# EAGLE design mppt (EAGLE 9.6.1)
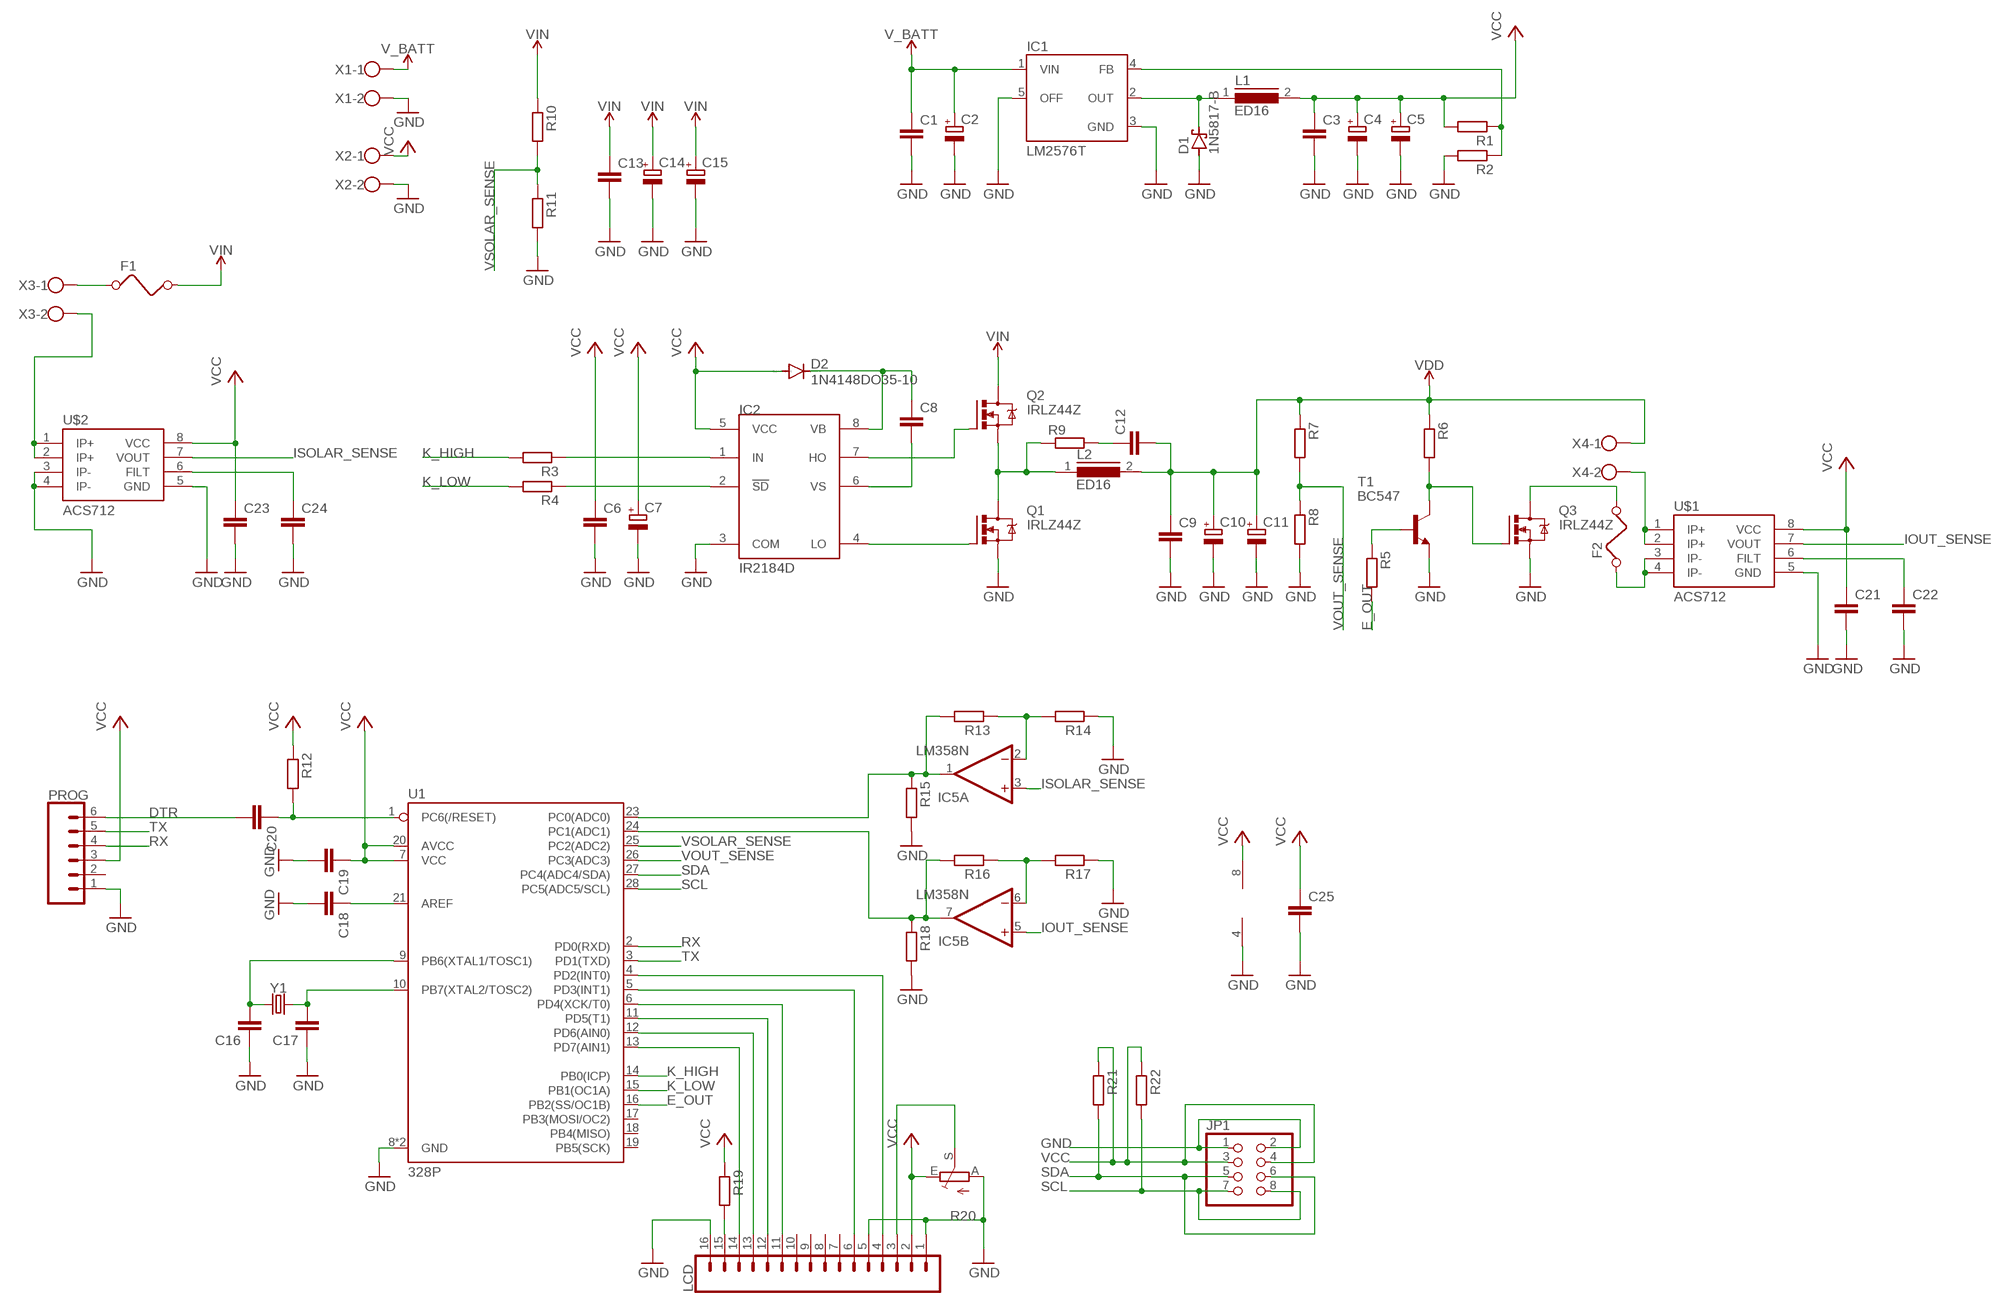
[diagram p0: schematic, sheet 1]

## Parts
C1  C-EU025-024X044  [C025-024X044]
C2  CPOL-EUE5-6  [E5-6]
C3  C-EU025-024X044  [C025-024X044]
C4  CPOL-EUE5-6  [E5-6]
C5  CPOL-EUE5-6  [E5-6]
C6  C-EU025-024X044  [C025-024X044]
C7  CPOL-EUE5-6  [E5-6]
C8  C-EU025-024X044  [C025-024X044]
C9  C-EU025-024X044  [C025-024X044]
C10  CPOL-EUE7.5-16  [E7,5-16]
C11  CPOL-EUE7.5-16  [E7,5-16]
C12  C-EU025-024X044  [C025-024X044]
C13  C-EU025-024X044  [C025-024X044]
C14  CPOL-EUE7.5-16  [E7,5-16]
C15  CPOL-EUE7.5-16  [E7,5-16]
C16  C-EU025-024X044  [C025-024X044]
C17  C-EU025-024X044  [C025-024X044]
C18  C-EU025-024X044  [C025-024X044]
C19  C-EU025-024X044  [C025-024X044]
C20  C-EU025-024X044  [C025-024X044]
C21  C-EU025-024X044  [C025-024X044]
C22  C-EU025-024X044  [C025-024X044]
C23  C-EU025-024X044  [C025-024X044]
C24  C-EU025-024X044  [C025-024X044]
C25  C-EU025-024X044  [C025-024X044]
D1  1N5817-B  [DO41-7.6]
D2  1N4148DO35-10  [DO35-10]
F1  FUSE  [FUSE]
F2  FUSE  [FUSE]
IC1  LM2576T  [TO220-5]
IC2  IR2184D  [DIL08]
IC5  LM358N  [DIL08]
JP1  PINHD-2X4  [2X04]
L1  ED16  [ED16]
L2  ED16  [ED16]
LCD  CONN_16LONGPADS  [1X16_LONGPADS]
PROG  CONN_06LONGPADS  [1X06_LONGPADS]
Q1  IRLZ44Z  [TO220BH]
Q2  IRLZ44Z  [TO220BH]
Q3  IRLZ44Z  [TO220BH]
R1  R-EU_0207/10  [0207/10]
R2  R-EU_0207/10  [0207/10]
R3  R-EU_0207/10  [0207/10]
R4  R-EU_0207/10  [0207/10]
R5  R-EU_0207/10  [0207/10]
R6  R-EU_0207/10  [0207/10]
R7  R-EU_0207/10  [0207/10]
R8  R-EU_0207/10  [0207/10]
R9  R-EU_0207/10  [0207/10]
R10  R-EU_0207/10  [0207/10]
R11  R-EU_0207/10  [0207/10]
R12  R-EU_0207/10  [0207/10]
R13  R-EU_0207/10  [0207/10]
R14  R-EU_0207/10  [0207/10]
R15  R-EU_0207/10  [0207/10]
R16  R-EU_0207/10  [0207/10]
R17  R-EU_0207/10  [0207/10]
R18  R-EU_0207/10  [0207/10]
R19  R-EU_0207/10  [0207/10]
R20  TRIM_EU-B64Y  [B64Y]
R21  R-EU_0207/10  [0207/10]
R22  R-EU_0207/10  [0207/10]
T1  BC547  [TO92]
U1  328P  ATMEGA328P_PDIP  [DIP28]
U$1  ACS712  [SO08]
U$2  ACS712  [SO08]
X1  W237-102  [W237-102]
X2  W237-102  [W237-102]
X3  W237-102  [W237-102]
X4  W237-102  [W237-102]
Y1  CRYSTALPTH-HC49UV  [HC49U]

## Nets
DTR: C20.2 PROG.6
E_OUT: R5.2 U1.16(PB2(SS/OC1B))
GND: C1.2 C2.- C3.2 C4.- C5.- C6.2 C7.- C9.2 C10.- C11.- C13.2 C14.- C15.- C16.1 C17.1 C18.2 C19.2 C21.2 C22.2 C23.2 C24.2 C25.2 D1.A IC1.3(GND) IC1.5(OFF) IC2.3(COM) IC5.4(P:V-) JP1.1 JP1.2 LCD.1 LCD.5 LCD.16 PROG.1 Q1.S Q3.S R2.2 R8.2 R11.2 R14.1 R15.2 R17.1 R18.2 R20.A T1.1(E) U1.8(GND) U1.22(GND) U$1.5(GND) U$2.3(IP-) U$2.4(IP-) U$2.5(GND) X1.2 X2.2
IOUT_SENSE: IC5.5(B:+IN) U$1.7(VOUT)
ISOLAR_SENSE: IC5.3(A:+IN) U$2.7(VOUT)
K_HIGH: R3.2 U1.14(PB0(ICP))
K_LOW: R4.2 U1.15(PB1(OC1A))
N$1: L2.1 Q1.D Q2.S R9.1
N$2: D1.C IC1.2(OUT) L1.1
N$3: IC2.7(HO) Q2.G
N$4: IC1.4(FB) R1.1 R2.1
N$5: IC2.4(LO) Q1.G
N$6: IC5.1(A:OUT) R13.2 R15.1 U1.23(PC0(ADC0))
N$7: IC2.1(IN) R3.1
N$8: IC2.2(!SD) R4.1
N$9: R5.1 T1.2(B)
N$10: Q3.G R6.2 T1.3(C)
N$11: C22.1 U$1.6(FILT)
N$12: F2.2 Q3.D
N$13: LCD.15 R19.2
N$14: IC5.7(B:OUT) R16.2 R18.1 U1.24(PC1(ADC1))
N$15: C24.1 U$2.6(FILT)
N$16: C16.2 U1.9(PB6(XTAL1/TOSC1)) Y1.1
N$17: C12.1 R9.2
N$18: C17.2 U1.10(PB7(XTAL2/TOSC2)) Y1.2
N$19: C20.1 R12.2 U1.1(PC6(/RESET))
N$20: U$2.1(IP+) U$2.2(IP+) X3.2
N$21: F1.1 X3.1
N$22: C18.1 U1.21(AREF)
N$23: F2.1 U$1.3(IP-) U$1.4(IP-)
N$24: IC5.2(A:-IN) R13.1 R14.2
N$25: IC5.6(B:-IN) R16.1 R17.2
N$26: LCD.3 R20.S
N$27: LCD.4 U1.4(PD2(INT0))
N$28: LCD.6 U1.5(PD3(INT1))
N$29: LCD.11 U1.6(PD4(XCK/T0))
N$30: LCD.12 U1.11(PD5(T1))
N$31: LCD.13 U1.12(PD6(AIN0))
N$32: LCD.14 U1.13(PD7(AIN1))
N$33: U$1.1(IP+) U$1.2(IP+) X4.2
RX: PROG.4 U1.2(PD0(RXD))
SCL: JP1.7 JP1.8 R22.2 U1.28(PC5(ADC5/SCL))
SDA: JP1.5 JP1.6 R21.2 U1.27(PC4(ADC4/SDA))
TX: PROG.5 U1.3(PD1(TXD))
V_BATT: C1.1 C2.+ IC1.1(VIN) X1.1
VB: C8.1 D2.C IC2.8(VB)
VCC: C3.1 C4.+ C5.+ C6.1 C7.+ C19.1 C21.1 C23.1 C25.1 D2.A IC2.5(VCC) IC5.8(P:V+) JP1.3 JP1.4 L1.2 LCD.2 PROG.3 R1.2 R12.1 R19.1 R20.E R21.1 R22.1 U1.7(VCC) U1.20(AVCC) U$1.8(VCC) U$2.8(VCC) X2.1
VDD: C9.1 C10.+ C11.+ C12.2 L2.2 R6.1 R7.1 X4.1
VIN: C13.1 C14.+ C15.+ F1.2 Q2.D R10.1
VOUT_SENSE: R7.2 R8.1 U1.26(PC3(ADC3))
VS: C8.2 IC2.6(VS)
VSOLAR_SENSE: R10.2 R11.1 U1.25(PC2(ADC2))
Unconnected: LCD.7 LCD.8 LCD.9 LCD.10 PROG.2 U1.17(PB3(MOSI/OC2)) U1.18(PB4(MISO)) U1.19(PB5(SCK))

## Library data of the parts
C1 C3 C6 C8 C9 C12 C13 C16-C25 = rcl:C-EU: CAPACITOR, European symbol; SPICEPREFIX: C
C2 C4 C5 C7 C10 C11 C14 C15 = rcl:CPOL-EU: POLARIZED CAPACITOR, European symbol; SPICEPREFIX: C
D1 = diode:1N581*: 1.0A SCHOTTKY BARRIER RECTIFIER Source: http://www.diodes.com/datasheets/ds23001.pdf
D2 = diode:1N4148: DIODE high speed (Philips)
F1 F2 = special:FUSE: FUSE 5 x 20 mm
IC1 = v-reg-3:LM2576: National Semiconductor <http://www.national.com> 3.0A "Simple Switcher"(c) 52kHz, Vout 1.23-37V (HV: 57V), Vin 40V (HV: 60V), 50µA standby current
IC2 = irs:IR2184
IC5 = linear:LM358: OP AMP also LM158; LM258; LM2904 Source: http://cache.national.com/ds/LM/LM158.pdf
JP1 = adafruit:PINHD-2X4: PIN HEADER
L1 L2 = inductors:ED16: INDUCTOR; SPICEPREFIX: L
LCD = SparkFun-Connectors:CONN_16: Multi connection point. Often used as Generic Header-pin footprint for 0.1 inch spaced/style header connections On any of the 0.1 inch spaced packages, you can populate with these: Break Away Headers - Straight <https://www.sparkfun.com/products/116> (PRT-00116) Break Away Male Headers - Right Angle <https://www.sparkfun.com/products/553> (PRT-00553) Female Headers <https://www.sparkfun.com/products/115> (PRT-00115) Break Away Headers - Machine Pin <https://www.sparkfun.com/products/117> (PRT-00117) Break Away Female Headers - Swiss Machine Pin <https://www.sparkfun.com/products/743> (PRT-00743) For SCREWTERMINALS and SPRING TERMINALS visit here: Screw Terimnals on SparkFun.com <https://www.sparkfun.com/search/results?term=Screw+Terminals> (5mm/3.5mm/2.54mm spacing) This device is also useful as a general connection point to wire up your design to another part of your project. Our various solder wires solder well into these plated through hole pads. Hook-Up Wire - Assortment (Stranded, 22 AWG) <https://www.sparkfun.com/products/11375> (PRT-11375) Hook-Up Wire - Assortment (Solid Core, 22 AWG) <https://www.sparkfun.com/products/11367> (PRT-11367) View the entire wire category on our website here <https://www.sparkfun.com/categories/141> Special notes: Molex polarized connector foot print use with SKU : PRT-08231 with associated crimp pins and housings. 1MM SMD Version SKU: PRT-10208 NOTES ON THE VARIANTS LOCK and LOCK_LONGPADS... This footprint was designed to help hold the alignment of a through-hole component (i.e. 6-pin header) while soldering it into place. You may notice that each hole has been shifted either up or down by 0.005 of an inch from it's more standard position (which is a perfectly straight line). This slight alteration caused the pins (the squares in the middle) to touch the edges of the holes. Because they are alternating, it causes a "brace" to hold the component in place. 0.005 has proven to be the perfect amount of "off-center" position when using our standard breakaway headers. Although looks a little odd when you look at the bare footprint, once you have a header in there, the alteration is very hard to notice. Also,if you push a header all the way into place, it is covered up entirely on the bottom side.
PROG = SparkFun-Connectors:CONN_06: Multi connection point. Often used as Generic Header-pin footprint for 0.1 inch spaced/style header connections On any of the 0.1 inch spaced packages, you can populate with these: Break Away Headers - Straight <https://www.sparkfun.com/products/116> (PRT-00116) Break Away Male Headers - Right Angle <https://www.sparkfun.com/products/553> (PRT-00553) Female Headers <https://www.sparkfun.com/products/115> (PRT-00115) Break Away Headers - Machine Pin <https://www.sparkfun.com/products/117> (PRT-00117) Break Away Female Headers - Swiss Machine Pin <https://www.sparkfun.com/products/743> (PRT-00743) Arduino Stackable Header - 6 Pin <https://www.sparkfun.com/products/9280> (PRT-09280) For SCREWTERMINALS and SPRING TERMINALS visit here: Screw Terimnals on SparkFun.com <https://www.sparkfun.com/search/results?term=Screw+Terminals> (5mm/3.5mm/2.54mm spacing) This device is also useful as a general connection point to wire up your design to another part of your project. Our various solder wires solder well into these plated through hole pads. Hook-Up Wire - Assortment (Stranded, 22 AWG) <https://www.sparkfun.com/products/11375> (PRT-11375) Hook-Up Wire - Assortment (Solid Core, 22 AWG) <https://www.sparkfun.com/products/11367> (PRT-11367) View the entire wire category on our website here <https://www.sparkfun.com/categories/141>
Q1-Q3 = transistor-power:IRLZ44Z: N-Channel HEXFET® Power MOSFET Logic Level AUTOMOTIVE MOSFET Source: http://www.irf.com/product-info/datasheets/data/irlz44zpbf.pdf
R1-R19 R21 R22 = rcl:R-EU_: RESISTOR, European symbol; SPICEPREFIX: R
R20 = pot:TRIM_EU-: POTENTIOMETER
T1 = transistor:BC547: NPN TRANSISTOR
U1 = SparkFun-IC-Microcontroller:ATMEGA328P_PDIP: Atmel 328P Through hole ATMEGA328P uC used in the Arduino 32kb flash, 1k EEPROM, 2k SRAM Datasheet <http://www.sparkfun.com/datasheets/Components/SMD/ATMega328.pdf> SparkFun Products Storefront component: AVR 28 Pin 20MHz 32K 6A/D - ATMega328P <https://www.sparkfun.com/products/9061> (COM-09061) SparkFun Simon Says - Through-Hole Soldering Kit <https://www.sparkfun.com/products/10547> (KIT-10547) SparkFun Learn to Solder - Simon Says <https://www.sparkfun.com/products/13708> (KIT-13708) SparkFun BigTime Watch Kit <https://www.sparkfun.com/products/11734> (KIT-11734) SparkFun ClockIt <https://www.sparkfun.com/products/10930> (KIT-10930) SparkFun Serial Enabled LCD Kit <https://www.sparkfun.com/products/10097> (LCD-10097) SparkFun Simon Tilts - Through Hole Soldering Kit <https://www.sparkfun.com/products/12634> (KIT-12634) SparkFun Frequency Counter Kit <https://www.sparkfun.com/products/10140> (KIT-10140) FabFM Radio Kit <https://www.sparkfun.com/products/11043> (KIT-11043) SparkFun Binary Blaster Kit <https://www.sparkfun.com/products/12037> (KIT-12037) SparkFun Metro-Gnome <https://www.sparkfun.com/products/9236> (KIT-09236) ATmega328 with Arduino Optiboot (Uno) <https://www.sparkfun.com/products/10524> (DEV-10524); PROD_ID: IC-09136
U$1 U$2 = SparkFun-Sensors:ACS712: ACS712 Hall-effect-based isolated linear current sensor Datasheet <http://www.sparkfun.com/datasheets/BreakoutBoards/0712.pdf> SparkFun Products SparkFun Low Current Sensor Breakout - ACS712 <https://www.sparkfun.com/products/8883> (SEN-08883); PROD_ID: IC-08964
X1-X4 = con-wago-500:W237-102: WAGO SCREW CLAMP; MPN: 237-102; OC_FARNELL: unknown; OC_NEWARK: 70K9898
Y1 = SparkFun-Clocks:CRYSTAL: Crystals (Generic) These are passive quartz crystals, which can be used as a clock source for a microcontroller. Crystal's are two-terminal devices. They require external "load" capacitors to generate an oscillating signal.

## Board
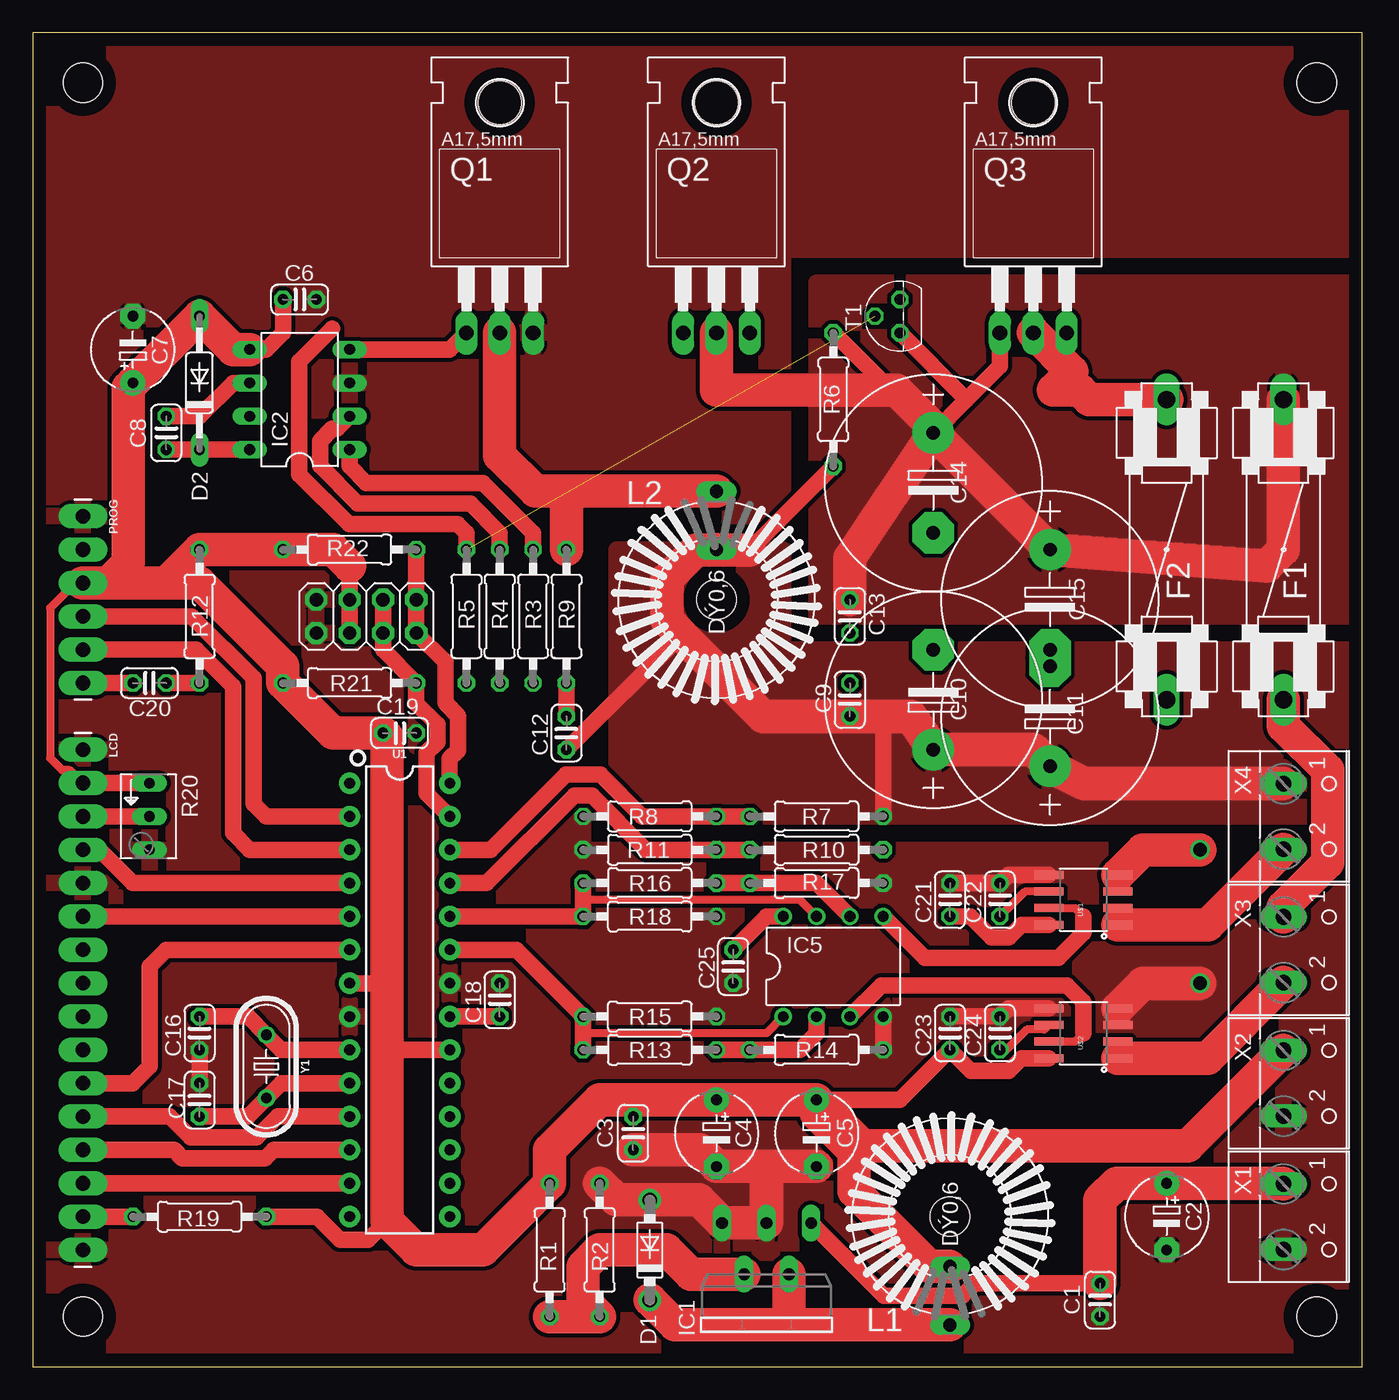
[diagram p1: board, top side]
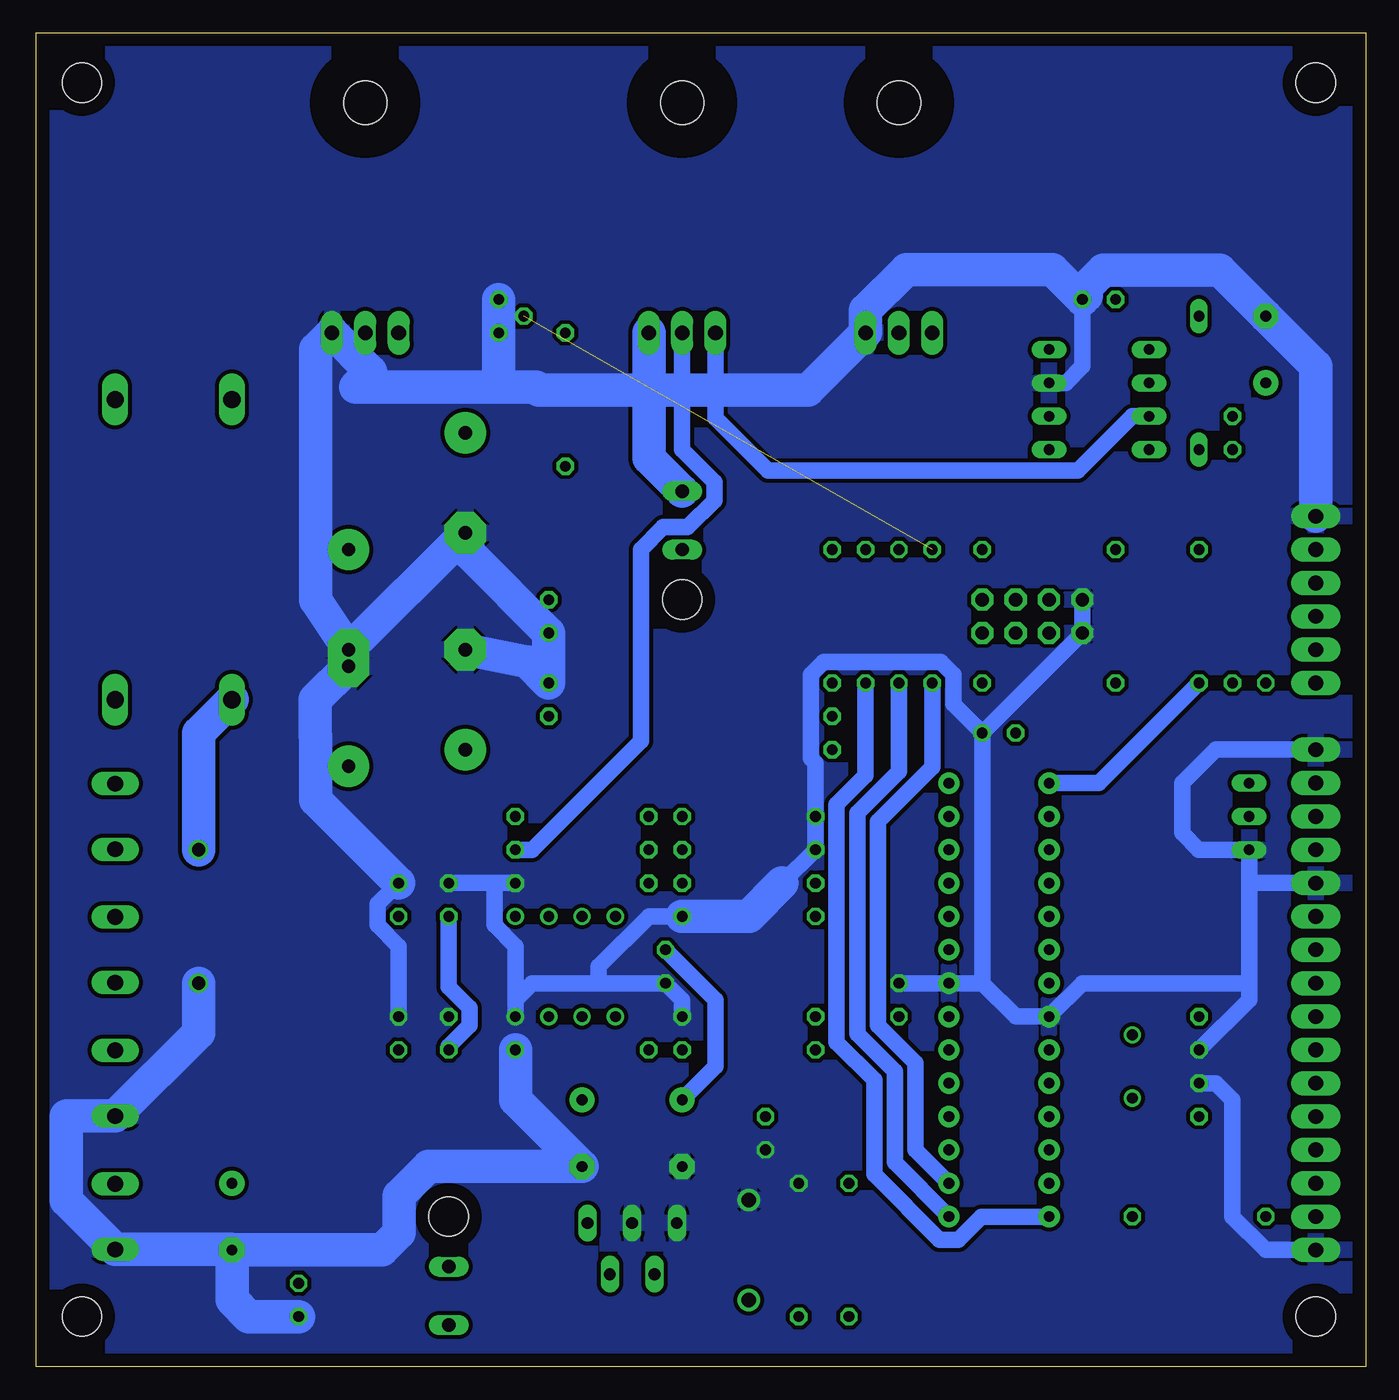
[diagram p2: board, bottom side, seen from below]

Size 101.27 x 101.59 mm. Coordinates in mm from the lower left corner, seen from the top.
Outline: 0,0 101.27,0 101.27,101.59 0,101.59 0,0
Copper layers (1*16): Top 0.035mm / dielectric 1.5mm / Bottom 0.035mm
Design rules "default *": minimum track width 6mil, minimum drill 0.35mm, track to track 12mil, track to pad 12mil, pad to pad 12mil, via to via 12mil, smd to smd 12mil, copper to edge 40mil, drill to drill 6mil, minimum pad ring 10mil, minimum via ring 8mil, stop-mask expansion 4mil, vias tented up to drill 0mil, thermal gap 10mil
Holes 3 mm at 3.81,97.79 3.81,3.81 97.79,3.81 97.79,97.79 52.07,58.42 69.85,11.43

### Footprints (pad centres in the part's own frame; a part is rotated, then mirrored left to right if it is on the bottom)
C025-024X044 = drill 0.813 octagon: 1 -1.27,0; 2 1.27,0
E5-6 = drill 0.813 pad 1.905: + -2.54,0 | drill 0.813 pad 1.905 octagon: - 2.54,0
E7,5-16 = drill 1.016 pad 3.15: + -3.81,0 | drill 1.016 pad 3.15 octagon: - 3.81,0
DO41-7.6 = drill 1.1 pad 1.7: A 3.81,0; C -3.81,0
DO35-10 = drill 0.813 long: A 5.08,0; C -5.08,0
FUSE = drill 1.321 long: 1 -11.43,0; 2 11.43,0
TO220-5 = drill 0.9 long: 1 -3.4,-8.4; 2 -1.7,-4.5; 3 0,-8.4; 4 1.7,-4.5; 5 3.4,-8.4
DIL08 = drill 0.813 long: 1 -3.81,-3.81; 2 -1.27,-3.81; 3 1.27,-3.81; 4 3.81,-3.81; 5 3.81,3.81; 6 1.27,3.81; 7 -1.27,3.81; 8 -3.81,3.81
DIL08' = drill 0.813 pad 1.27: 1 -3.81,-3.81; 2 -1.27,-3.81; 3 1.27,-3.81; 4 3.81,-3.81; 5 3.81,3.81; 6 1.27,3.81; 7 -1.27,3.81; 8 -3.81,3.81
2X04 = drill 1.016 pad 1.676 octagon: 1 -3.81,-1.27; 2 -3.81,1.27; 3 -1.27,-1.27; 4 -1.27,1.27; 5 1.27,-1.27; 6 1.27,1.27; 7 3.81,-1.27; 8 3.81,1.27
ED16 = drill 1.016 long: 1 -8.255,0; 2 -3.81,0
1X16_LONGPADS = drill 1.118 pad 1.88 long: 1 0,0; 2 2.54,0; 3 5.08,0; 4 7.62,0; 5 10.16,0; 6 12.7,0; 7 15.24,0; 8 17.78,0; 9 20.32,0; 10 22.86,0; 11 25.4,0; 12 27.94,0; 13 30.48,0; 14 33.02,0; 15 35.56,0; 16 38.1,0
1X06_LONGPADS = drill 1.118 pad 1.88 long: 1 0,0; 2 2.54,0; 3 5.08,0; 4 7.62,0; 5 10.16,0; 6 12.7,0
TO220BH = drill 1.118 long: D 0,-6.35; G -2.54,-6.35; S 2.54,-6.35 | hole 3.302: 0,11.176
0207/10 = drill 0.813 octagon: 1 -5.08,0; 2 5.08,0
B64Y = drill 0.813 long: A 2.54,0; E -2.54,0; S 0,0
TO92 = drill 0.813 octagon: 1 1.27,0; 2 0,1.905; 3 -1.27,0
DIP28 = drill 0.813 pad 1.626: 1 -16.51,-3.81; 2 -13.97,-3.81; 3 -11.43,-3.81; 4 -8.89,-3.81; 5 -6.35,-3.81; 6 -3.81,-3.81; 7 -1.27,-3.81; 8 1.27,-3.81; 9 3.81,-3.81; 10 6.35,-3.81; 11 8.89,-3.81; 12 11.43,-3.81; 13 13.97,-3.81; 14 16.51,-3.81; 15 16.51,3.81; 16 13.97,3.81; 17 11.43,3.81; 18 8.89,3.81; 19 6.35,3.81; 20 3.81,3.81; 21 1.27,3.81; 22 -1.27,3.81; 23 -3.81,3.81; 24 -6.35,3.81; 25 -8.89,3.81; 26 -11.43,3.81; 27 -13.97,3.81; 28 -16.51,3.81
SO08 = smd 0.61 x 2.21: 1 -1.905,-2.616; 2 -0.635,-2.616; 3 0.635,-2.616; 4 1.905,-2.616; 5 1.905,2.616; 6 0.635,2.616; 7 -0.635,2.616; 8 -1.905,2.616
W237-102 = drill 1.194 long: 1 -2.5,-1.27; 2 2.5,-1.27
HC49U = drill 0.813: 1 -2.413,0; 2 2.413,0

### Placement (x,y rotation side)
C1  81.28,5.08 270 top
C2  86.36,11.43 270 top
C3  45.72,17.78 270 top
C4  52.07,17.78 270 top
C5  59.69,17.78 270 top
C6  20.32,81.28 0 top
C7  7.62,77.47 90 top
C8  10.16,71.12 90 top
C9  62.23,50.8 90 top
C10  68.58,50.8 90 top
C11  77.47,49.53 90 top
C12  40.64,48.26 270 top
C13  62.23,57.15 270 top
C14  68.58,67.31 270 top
C15  77.47,58.42 270 top
C16  12.7,25.4 90 top
C17  12.7,20.32 270 top
C18  35.56,27.94 90 top
C19  27.94,48.26 0 top
C20  8.89,52.07 180 top
C21  69.85,35.56 90 top
C22  73.66,35.56 90 top
C23  69.85,25.4 90 top
C24  73.66,25.4 90 top
C25  53.34,30.48 270 top
D1  46.99,8.89 90 top
D2  12.7,74.93 90 top
F1  95.25,62.23 90 top
F2  86.36,62.23 90 top
IC1  55.88,2.54 180 top
IC2  20.32,73.66 90 top
IC5  LM358N  [DIL08']  60.96,30.48 0 top
JP1  25.4,57.15 0 top
L1  69.85,11.43 90 top
L2  52.07,58.42 270 top
LCD  3.81,46.99 270 top
PROG  3.81,64.77 270 top
Q1  35.56,85.09 0 top
Q2  52.07,85.09 0 top
Q3  76.2,85.09 0 top
R1  39.37,8.89 90 top
R2  43.18,8.89 90 top
R3  38.1,57.15 270 top
R4  35.56,57.15 270 top
R5  33.02,57.15 270 top
R6  60.96,73.66 90 top
R7  59.69,41.91 180 top
R8  46.99,41.91 180 top
R9  40.64,57.15 270 top
R10  59.69,39.37 180 top
R11  46.99,39.37 180 top
R12  12.7,57.15 270 top
R13  46.99,24.13 180 top
R14  59.69,24.13 180 top
R15  46.99,26.67 0 top
R16  46.99,36.83 180 top
R17  59.69,36.83 180 top
R18  46.99,34.29 0 top
R19  12.7,11.43 180 top
R20  8.89,41.91 270 top
R21  24.13,52.07 0 top
R22  24.13,62.23 0 top
T1  66.04,80.01 90 top
U1  27.94,27.94 270 top
U$1  80.01,35.56 90 top
U$2  80.01,25.4 90 top
X1  96.52,11.43 270 top
X2  96.52,21.59 270 top
X3  96.52,31.75 270 top
X4  96.52,41.91 270 top
Y1  17.78,22.86 270 top

### Tracks (layer width: path | path; a pad name or v marks a point on that pad's centre or on a via)
DTR
  Top 1.27: PROG.6 C20.2
E_OUT
  Bottom 1.27: R5.2 33.02,45.66 37.16,41.52 37.16,26.01 34.29,23.14 34.29,16.51 U1.16
GND  (via drill 1)
  Top 0.508: U$2.4 U$2.3
  Top 1.27: C16.1 C17.1 | U$1.5 74.3,37.47 C22.2 C21.2 | U$2.5 74.3,27.3 C24.2 C23.2 | IC5.4 R14.1
  Top 2.54: R2.2 44.45,12.7 D1.A 50.72,12.7 IC1.5 IC1.3 55.88,15.24 | C3.2 50.8,16.51 C4.- 55.88,15.24 | 55.88,15.24 C5.- | U$2.4 84.53,29.21 v88.9,29.21
  Bottom 1.27: C16.1 8.89,27.94 8.89,29.21 | 8.89,29.21 8.89,36.83 | 8.89,36.83 R20.A 12.7,39.37 13.97,40.64 13.97,44.45 11.43,46.99 LCD.1 | LCD.5 8.89,36.83 | 8.89,29.21 21.59,29.21 U1.8 26.67,26.67 29.21,29.21 | 29.21,29.21 U1.22 C18.2 | C19.2 29.21,29.21 | LCD.16 7.62,8.89 10.16,11.43 10.16,20.32 11.43,21.59 C17.1 | C24.2 73.66,32.03 75.26,33.63 75.26,35.23 C22.2 | R15.2 52.07,27.94 C25.2 58.42,29.21 | 58.42,29.21 63.5,29.21 64.77,27.94 IC5.4 64.77,32.03 66.37,33.63 66.37,36.5 66.04,36.83 | R18.2 54.61,34.29 58.42,30.48 58.42,29.21 | C21.2 66.04,36.83 | 66.04,36.83 R17.1 | 44.45,36.83 R11.2 R8.2 41.91,46 42.24,46.33 42.24,52.73 41.3,53.67 32.36,53.67 31.42,52.73 31.42,50.47 C19.2 | C6.2 21.59,76.2 22.86,74.93 IC2.3 | JP1.2 JP1.1 C19.2
  Bottom 2.54: C2.- 86.4,8.93 X1.2 98.98,12.66 98.98,19.05 98.94,19.09 X2.2 88.9,25.44 v88.9,29.21 | C1.2 85.09,3.81 86.36,5.08 C2.- | R18.2 46.99,34.29 44.45,36.83 | R14.1 64.77,20.32 C5.- 71.39,15.24 73.64,13 73.64,10.18 74.93,8.89 C2.- | PROG.1 3.81,76.2 C7.- 11.12,83.52 19.98,83.52 21.29,82.21 21.29,81.58 C6.2 23.88,83.57 34.98,83.57 38.1,80.45 Q1.S 42.47,74.37 62.95,74.37 63.21,74.62 66.04,74.62 | C15.- C11.- 80.01,50.8 80.01,48.05 80,48.04 80,43.17 C22.2 | C10.- 63.82,53.66 C9.2 C13.2 68.26,61.91 C14.- C15.- | C15.- 80,58.41 80,77.48 Q3.S 75.78,75.78 76.94,74.62 66.04,74.62 | T1.1 66.04,74.62
  pour Bottom: 1.27,100.33 100.33,100.33 100.33,1.27 1.27,1.27
  pour Top: 100.33,85.09 100.33,100.33 1.27,100.33 1.27,1.27 100.33,1.27 100.33,39.37 41.91,39.37 41.91,64.77 57.15,64.77 57.15,85.09
IOUT_SENSE
  Top 0.61: U$1.7 79.38,34.92 80.01,34.29
  Top 1.27: 80.01,34.29 80.01,33.02 78.11,31.11 67.94,31.11 IC5.5
ISOLAR_SENSE
  Top 0.61: U$2.7 79.38,24.77 80.01,25.4
  Top 1.27: 80.01,25.4 80.01,27.79 78.74,29.06 64.62,29.06 IC5.3
K_HIGH
  Bottom 1.27: R3.2 38.1,45.03 40.31,42.82 40.31,24.7 37.44,21.83 37.44,14.64 32.48,9.68 31.02,9.68 29.27,11.43 U1.14
K_LOW
  Bottom 1.27: R4.2 35.56,45.35 38.73,42.17 38.73,25.36 35.87,22.48 35.87,15.54 U1.15
N$1
  Top 2.54: 40.64,66.67 38.29,66.67 35.56,69.41 Q1.D | 40.64,66.67 L2.1 | R9.1 40.64,66.67
  Bottom 2.54: L2.1 54.61,69.22 Q2.S
N$2
  Top 2.54: D1.C 48.9,3.17 57.15,3.17 | 57.15,3.17 L1.1 | IC1.2 57.58,3.6 57.15,3.17
N$3
  Bottom 1.27: Q2.G 49.53,72.25 45.53,68.25 21.92,68.25 17.78,72.39 IC2.7
N$4
  Top 2.54: R1.1 R2.1 41.91,5.08 41.91,7.62 43.18,8.89 48.26,8.89 50.11,7.04 IC1.4
N$5
  Top 1.27: Q1.G 31.75,77.47 IC2.4
N$6
  Top 0.61: IC5.1 55.88,25.4 41.91,25.4
  Top 1.27: R13.2 41.91,25.4 R15.1 36.83,31.75 U1.23
N$7
  Top 1.27: R3.1 38.1,63.5 34.29,67.31 25.4,67.31 24.13,68.58 IC2.1
N$8
  Top 1.27: R4.1 35.56,63.5 33.33,65.73 24.75,65.73 21.87,68.61 21.87,70.51 22.81,71.45 23.19,71.45 IC2.2
N$9  (1 unrouted)
  Top 1.27: R5.1 33.02,63.5 32.36,64.16 24.09,64.16 20.3,67.96 20.3,76.56 22.81,79.07
N$10
  Top 1.27: T1.3 71.12,73.66 | R6.2 68.58,71.12 71.12,73.66 | 71.12,73.66 73.66,76.2 Q3.G
N$11
  Top 0.61: U$1.6 75.56,36.2 C22.1
N$12
  Top 2.54: Q3.D 79.16,75.78 77.74,74.37 79.74,74.37 80.45,73.66 F2.2
N$13
  Top 1.27: LCD.15 R19.2
N$14
  Top 0.61: IC5.7 58.42,35.56 41.91,35.56
  Top 1.27: R16.2 41.91,35.56 R18.1 U1.24
N$15
  Top 0.61: U$2.6 77.04,25.68 75.71,25.68 74.16,24.13 C24.1
N$16
  Top 1.27: U1.9 18.92,24.13 Y1.1 16.38,26.67 C16.2
N$17
  Top 1.27: C12.1 R9.2
N$18
  Top 1.27: U1.10 18.92,21.59 Y1.2 16.38,19.05 C17.2
N$19
  Top 1.27: C20.1 R12.2
  Bottom 1.27: U1.1 20.32,44.45 R12.2
N$20
  Top 0.508: U$2.2 U$2.1
  Top 2.54: U$2.1 89.5,23.5 X3.2
N$21
  Top 2.54: F1.1 95.25,48.8 98.61,45.43 98.61,38.39 95.25,35.02 X3.1
N$22
  Top 1.27: C18.1 U1.21
N$23  (via drill 1)
  Top 0.508: U$1.4 U$1.3
  Top 2.54: U$1.4 84.53,39.37 v88.9,39.37
  Bottom 2.54: F2.1 88.9,48.26 v88.9,39.37
N$24
  Top 1.27: R13.1 R14.2 58.42,24.13 59.69,25.4 IC5.2
N$25
  Top 1.27: IC5.6 59.69,36.83 R17.2 R16.1
N$26
  Top 1.27: LCD.3 R20.S
N$27
  Top 1.27: LCD.4 5.08,39.37 7.62,36.83 U1.4
N$28
  Top 1.27: LCD.6 U1.5
N$29
  Top 1.27: U1.6 10.16,31.75 8.89,30.48 8.89,22.86 7.62,21.59 LCD.11
N$30
  Top 1.27: U1.11 18.65,19.05 17.05,17.45 12.04,17.45 10.44,19.05 LCD.12
N$31
  Top 1.27: U1.12 18.33,16.51 17.7,15.88 11.38,15.88 10.75,16.51 LCD.13
N$32
  Top 1.27: U1.13 LCD.14
N$33
  Top 0.508: U$1.2 U$1.1
  Top 2.54: U$1.1 89.5,33.66 X4.2
RX
  Top 1.27: PROG.4 12.11,57.15 16.82,52.45 16.82,42.88 17.78,41.91 U1.2
SCL
  Top 1.27: R22.2 JP1.8 JP1.7 31.42,53.67 31.42,50.54 32.38,49.58 32.38,46.95 31.75,46.31 U1.28
SDA
  Top 1.27: JP1.6 JP1.5 26.67,54.61 R21.2 29.21,50.52 30.81,48.92 30.81,47.6 30,46.78 30,43.66 U1.27
TX
  Top 1.27: PROG.5 12.42,54.61 15.24,51.79 15.24,40.64 16.51,39.37 U1.3
V_BATT
  Top 1.27: IC1.1 64.81,5.41 70.81,5.41 71.75,6.35 C1.1
  Top 2.54: X1.1 95.21,13.97 C2.+ 82.55,13.97 81.28,12.7 C1.1
VB
  Top 1.27: IC2.8 D2.C C8.1
VCC
  Top 0.61: LCD.2 2.82,45.44 2.23,45.44 1.32,46.35 1.32,57.79 3.22,59.69 PROG.3
  Top 1.27: LCD.2 R20.E | C3.1 45.72,20.32 | C25.1 55.88,34.29 IC5.8 | C21.1 71.4,34.29 73,32.69 74.32,32.69 75.29,33.66 U$1.8 | U$2.8 75.29,23.5 74.32,22.53 71.45,22.53 C23.1 66.04,20.32 C5.+ | R19.1 21.65,11.43 23.4,9.68 25.53,9.68 26.98,11.12 | C6.1 19.05,78.74 17.78,77.47 IC2.5 | U1.7 26.98,29.21 | U1.20 26.98,24.13 | JP1.3 JP1.4 24.13,60.96
  Top 2.54: C5.+ C4.+ 45.72,20.32 43.18,20.32 39.37,16.51 R1.2 34.29,8.89 29.21,8.89 26.98,11.12 26.98,24.13 26.98,29.21 26.98,47.95 C19.1 22.86,48.26 R21.1 19.02,52.09 19.02,53.36 12.7,59.69 10.16,59.69 | X2.1 87.97,16.82 63.2,16.82 C5.+ | 5.79,59.72 7.26,61.19 7.26,74.57 C7.+ D2.A 15.24,77.47 IC2.5 | L1.2 69.83,7.64 68.28,7.64 62.53,13.39 62.53,16.42 59.69,19.26 C5.+ | 10.16,59.69 R12.1 R22.1 22.86,62.23 24.13,60.96 | 10.16,59.69 5.82,59.69 5.79,59.72 | 5.79,59.72 5.77,59.69 PROG.3
  Bottom 1.27: C23.1 69.85,24.41 68.25,26.01 68.25,27.33 69.85,28.93 C21.1 | C25.1 49.53,27.94 49.53,22.86 C4.+
VDD
  Top 1.27: C12.2 49.39,55.74 | R7.1 64.77,49.53 | R6.1 54.59,62.21
  Top 2.54: L2.2 52.05,62.21 | 54.59,62.21 52.05,62.21 | 52.05,62.21 50.5,62.21 48.28,59.99 48.28,56.85 49.39,55.74 55.61,49.53 C9.1 64.77,49.53 66.89,49.53 C10.+ 76.2,46.99 C11.+ 80.05,44.41 X4.1
  pour Top: 44.45,62.23 57.15,62.23 57.15,54.61 100.33,54.61 100.33,41.91 44.45,41.91
VIN
  Top 2.54: Q2.D 52.07,74.37 65.77,74.37 68.58,71.56 C14.+ | C14.+ C15.+ 93.98,60.96 95.25,62.23 F1.2 | C14.+ 62.23,61.59 C13.1
  Bottom 1.27: Q2.D 52.07,69.84 49.61,67.38 49.61,65.97 51.64,63.93 53.54,63.93 55.22,62.25 55.22,47.65 63.5,39.37 R10.1
  pour Top: 100.33,82.55 59.69,82.55 59.69,57.15 100.33,57.15
VOUT_SENSE
  Top 1.27: R7.2 R8.1 46.4,41.91 43.23,45.09 40.59,45.09 34.88,39.37 U1.26
VS
  Top 1.27: C8.2 12.7,72.39 15.24,74.93 IC2.6
VSOLAR_SENSE
  Top 1.27: R10.2 R11.1 46.71,39.37 42.57,43.51 41.25,43.51 34.57,36.83 U1.25

### Text on the board
tValues: GND | GND | +5V | SDA | SCL | NC | +5V | ~RX | I2C | ~TX | OUT | GND | SOL | GND | +5V | GND | BAT | GND